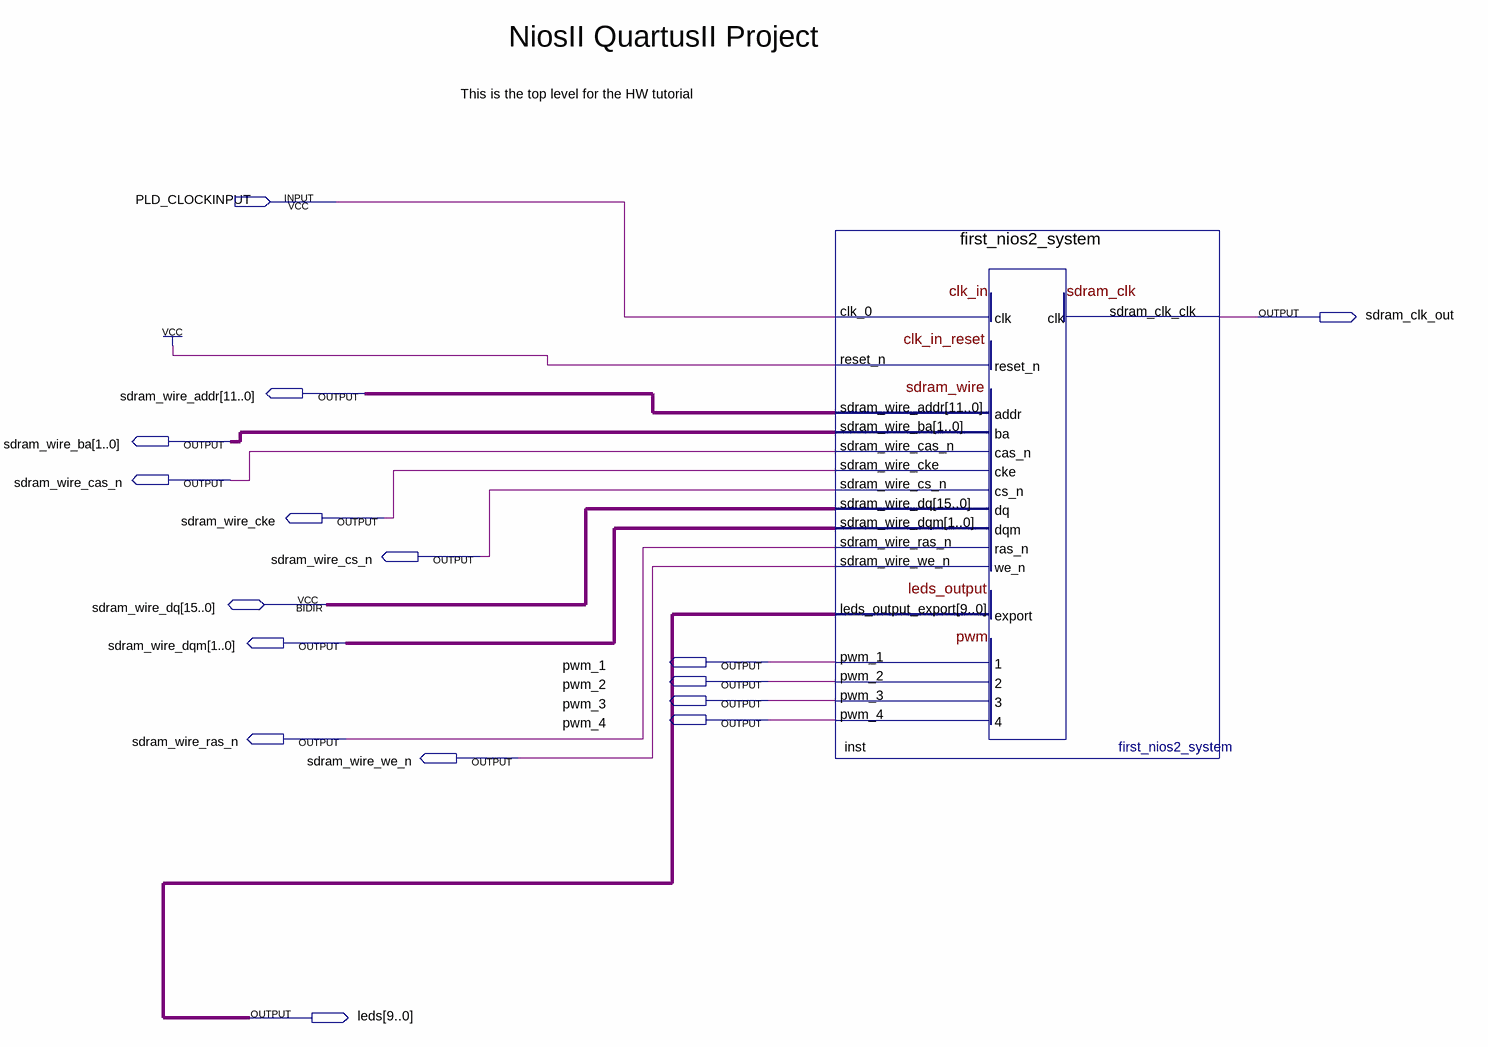
[diagram p0: schematic sheet]
// Quartus schematic nios2_quartus2_project.bdf as structural Verilog: 1 symbols, 16 pins
module nios2_quartus2_project (
  input  PLD_CLOCKINPUT,
  inout  [15:0] sdram_wire_dq,
  output sdram_clk_out,
  output [11:0] sdram_wire_addr,
  output [1:0] sdram_wire_ba,
  output sdram_wire_cas_n,
  output sdram_wire_cke,
  output sdram_wire_cs_n,
  output [1:0] sdram_wire_dqm,
  output pwm_1,
  output pwm_2,
  output pwm_3,
  output pwm_4,
  output sdram_wire_ras_n,
  output sdram_wire_we_n,
  output [9:0] leds
);

  first_nios2_system inst (
    .clk_0(PLD_CLOCKINPUT), .reset_n(1'b1), .sdram_wire_addr(sdram_wire_addr), .sdram_wire_ba(sdram_wire_ba),
    .sdram_wire_cas_n(sdram_wire_cas_n), .sdram_wire_cke(sdram_wire_cke), .sdram_wire_cs_n(sdram_wire_cs_n),
    .sdram_wire_dqm(sdram_wire_dqm), .sdram_wire_ras_n(sdram_wire_ras_n), .sdram_wire_we_n(sdram_wire_we_n),
    .sdram_clk_clk(sdram_clk_out), .leds_output_export(leds), .pwm_1(pwm_1), .pwm_2(pwm_2), .pwm_3(pwm_3),
    .pwm_4(pwm_4), .sdram_wire_dq(sdram_wire_dq));

  // Notes on the sheet:
  //   NiosII QuartusII Project
  //   This is the top level for the HW tutorial
endmodule
